# EAGLE design power (EAGLE 7.3.0)
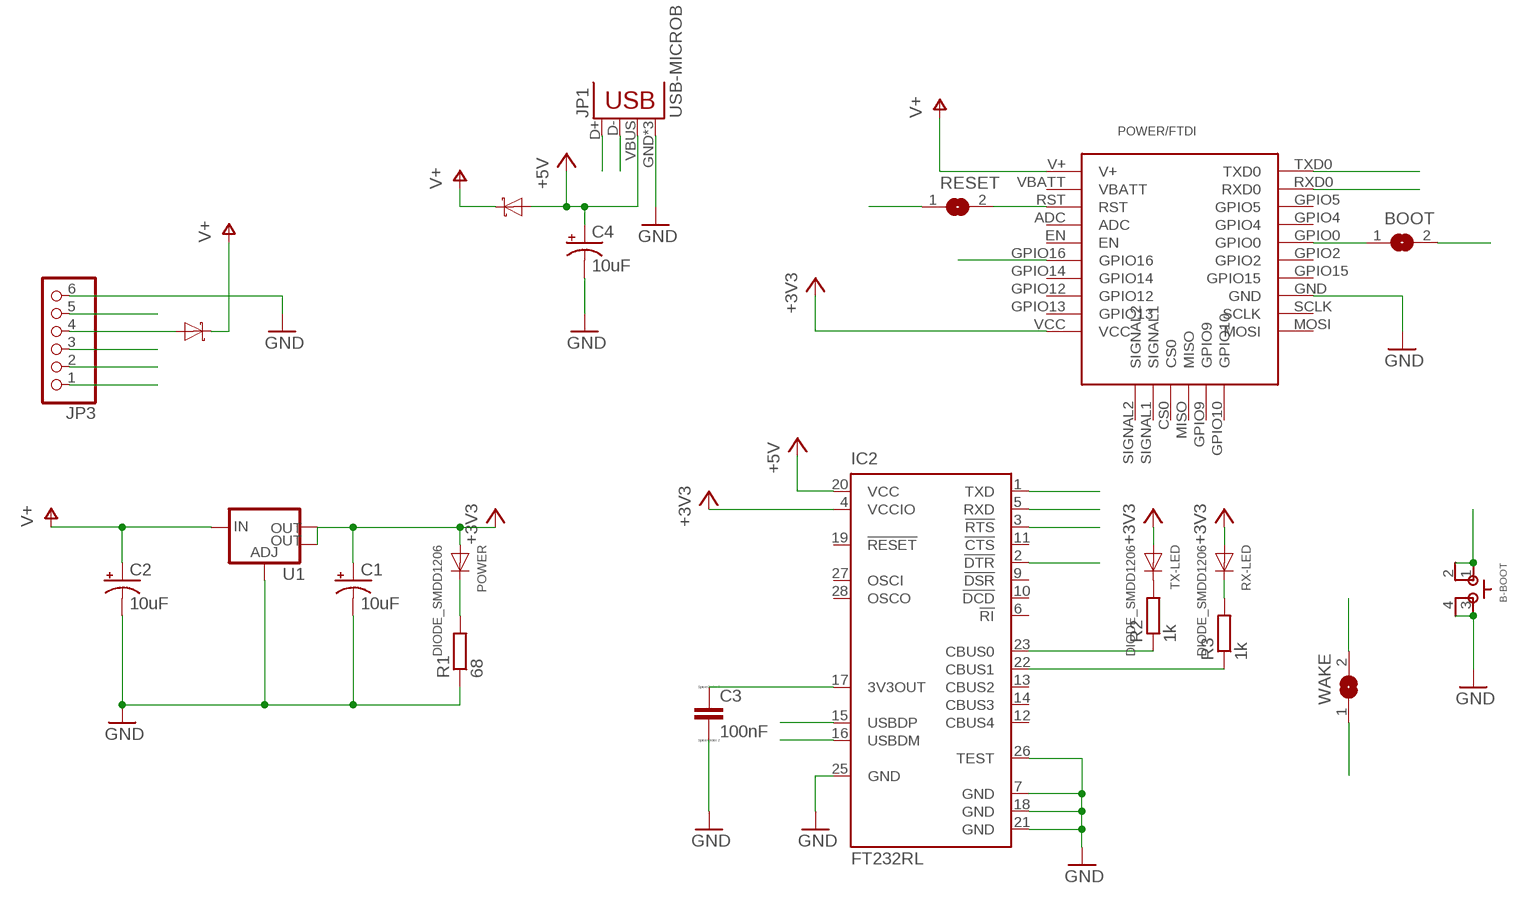
[diagram p0: schematic, sheet 1]

## Parts
B-BOOT  SKSCLDE010  [SKSCLDE010]
BOOT  SJ  [SJ]
C1  10uF  10UF-16V-10%(TANT)  [EIA3216]
C2  10uF  10UF-16V-10%(TANT)  [EIA3216]
C3  100nF  C  [C0805]
C4  10uF  10UF-16V-10%(TANT)  [EIA3216]
D1  MBR120  SCHOTTKY_DIODE_SMDSOD123  [SOD123]
D2  MBR120  SCHOTTKY_DIODE_SMDSOD123  [SOD123]
IC2  FT232RL  [SSOP28]
JP1  USB-MICROB  [USB-MICROB]
JP3  PINHD-1X6  [1X06]
POWER  DIODE_SMDD1206  [D1206]
POWER/FTDI  ESP-BOARD  [ESP-BOARD]
R1  68  RESISTOR-1206  [R1206]
R2  1k  RESISTOR-1206  [R1206]
R3  1k  RESISTOR-1206  [R1206]
RESET  SJ  [SJ]
RX-LED  DIODE_SMDD1206  [D1206]
TX-LED  DIODE_SMDD1206  [D1206]
U1  V_REG_LM1117SOT223  [SOT223]
WAKE  SJ  [SJ]

## Nets
+3V3: C1.A(+) IC2.4(VCCIO) POWER.A POWER/FTDI.VCC RX-LED.A TX-LED.A U1.2(OUT) U1.4(OUT)
+5V: C4.A(+) D1.A IC2.20(VCC) JP1.VBUS
D+: IC2.15(USBDP) JP1.D+
D-: IC2.16(USBDM) JP1.D-
DTR: B-BOOT.1 B-BOOT.2 BOOT.2 IC2.2(!DTR) JP3.5
GND: B-BOOT.3 B-BOOT.4 C1.C(-) C2.C(-) C3.2 C4.C(-) IC2.18(GND) IC2.21(GND) IC2.25(GND) IC2.26(TEST) JP1.GND JP1.MT1(GND) JP1.MT2(GND) JP3.6 POWER/FTDI.GND R1.1 U1.1(ADJ)
GPIO0: BOOT.1 POWER/FTDI.GPIO0
GPIO16: POWER/FTDI.GPIO16 WAKE.1
N$1: POWER.K R1.2
N$2: IC2.22(CBUS1) R3.1
N$3: R2.2 TX-LED.K
N$4: IC2.23(CBUS0) R2.1
N$8: D2.A JP3.4
N$9: R3.2 RX-LED.K
N$16: C3.1 IC2.17(3V3OUT)
RST: POWER/FTDI.RST RESET.2 WAKE.2
RTS: IC2.3(!RTS) JP3.1 RESET.1
RXD: IC2.5(RXD) JP3.2 POWER/FTDI.TXD0
TXD: IC2.1(TXD) JP3.3 POWER/FTDI.RXD0
V+: C2.A(+) D1.C D2.C POWER/FTDI.V+ U1.3(IN)
Unconnected: IC2.6(!RI) IC2.9(!DSR) IC2.10(!DCD) IC2.11(!CTS) IC2.12(CBUS4) IC2.13(CBUS2) IC2.14(CBUS3) IC2.19(!RESET) IC2.27(OSCI) IC2.28(OSCO) POWER/FTDI.ADC POWER/FTDI.CS0 POWER/FTDI.EN POWER/FTDI.GPIO2 POWER/FTDI.GPIO4 POWER/FTDI.GPIO5 POWER/FTDI.GPIO9 POWER/FTDI.GPIO10 POWER/FTDI.GPIO12 POWER/FTDI.GPIO13 POWER/FTDI.GPIO14 POWER/FTDI.GPIO15 POWER/FTDI.MISO POWER/FTDI.MOSI POWER/FTDI.SCLK POWER/FTDI.SIGNAL1 POWER/FTDI.SIGNAL2

## Power pins joined to a net without a drawn wire
GND: IC2.7(GND)
VBATT: POWER/FTDI.VBATT

## Library data of the parts
B-BOOT = ESPstack:SKSCLDE010
BOOT RESET WAKE = jumper:SJ: SMD solder JUMPER
C1 C2 C4 = SparkFun-Capacitors:10UF-16V-10%(TANT): CAP-00811 1206/EIA-3216 Tantalum capacitor; PROD_ID: CAP-00811
C3 = eagle-ltspice:C: CAPACITOR, European symbol; SPICEMODEL: NONE; SPICEPREFIX: C
D1 D2 = ESPstack:SCHOTTKY_DIODE_SMD: Schottky Diode Library Unspecified diode types but packages D0805 doplnit D0605 SMA SMB SMC SOD123 SOD323
IC2 = ftdichip:FT232R: Source: http://www.ftdichip.com/Documents/DataSheets/DS_FT232R_v104.pdf; MPN: FT232RL; OC_FARNELL: 1146032; OC_NEWARK: 91K9918
JP1 = SparkFun-Connectors:USB: USB Connectors USB-B-PTH is fully proven SKU : PRT-00139/CONN-08278 USB-miniB is fully proven SKU : PRT-00587 USB-A-PCB is untested. USB-A-H is throughly reviewed, but untested. Spark Fun Electronics SKU : PRT-00437 USB-B-SMT is throughly reviewed, but untested. Needs silkscreen touching up. USB-A-S has not been used/tested USB-MB-H has not been used/tested USB-MICROB has been used. CONN-09505; PROD_ID: CONN-09505
JP3 = ESPstack:PINHD-1X6: PIN HEADER
POWER RX-LED TX-LED = diodes_gen:DIODE_SMD: General Purpose Diode Library Unspecified diode types but packages D0805 doplnit D0605 D1206 SMA SMB SMC SOD123 SOD323 Diodes in 0603 package Typ Farnell number Link Notes TS4148RZG 8150192 Link <http://cz.farnell.com/taiwan-semiconductor/ts4148-rzg/diode-0-35a-603/dp/8150192> 1N41448 alt CD0603-S01xxx 7599754 Link <http://cz.farnell.com/bourns/cd0603-s0180r/switching-diode-90v-100ma-0603/dp/7599754> 1N41448 alt Diodes in 0805 package Typ Farnell number Link Notes TS4148RY 8150206 Link <http://cz.farnell.com/taiwan-semiconductor/ts4148-ry/diode-0-5a-0805-100v/dp/8150206> 1n4148 alt Diodes in 1202 package Typ Farnell number Link Notes TS4148RX 8150214 Link <http://cz.farnell.com/taiwan-semiconductor/ts4148-rx/diode-small-signal-100v-0-15a-1206/dp/8150214> CD1206-S01575 7599821 Link <http://cz.farnell.com/bourns/cd1206-s01575/switching-diode-100v-150ma-1206/dp/7599821> Diodes in SOD123 package Typ Farnell number Link Notes Link Diodes in SOD323 package Typ Farnell number Link Notes Link Diodes in SMA package Typ Farnell number Link Notes Link Diodes in SMB package Typ Farnell number Link Notes Link Diodes in SMC package Typ Farnell number Link Notes Link
POWER/FTDI = ESPstack:ESP-BOARD: STANDARIZED ESP-STACK BOARD
R1-R3 = dp_devices:RESISTOR
U1 = SparkFun-PowerIC:V_REG_LM1117: Voltage Regulator LM1117 Standard adjustable voltage regulator but in SMD form. Spark Fun Electronics SKU : COM-00595; PROD_ID: VREG-08170

## Board
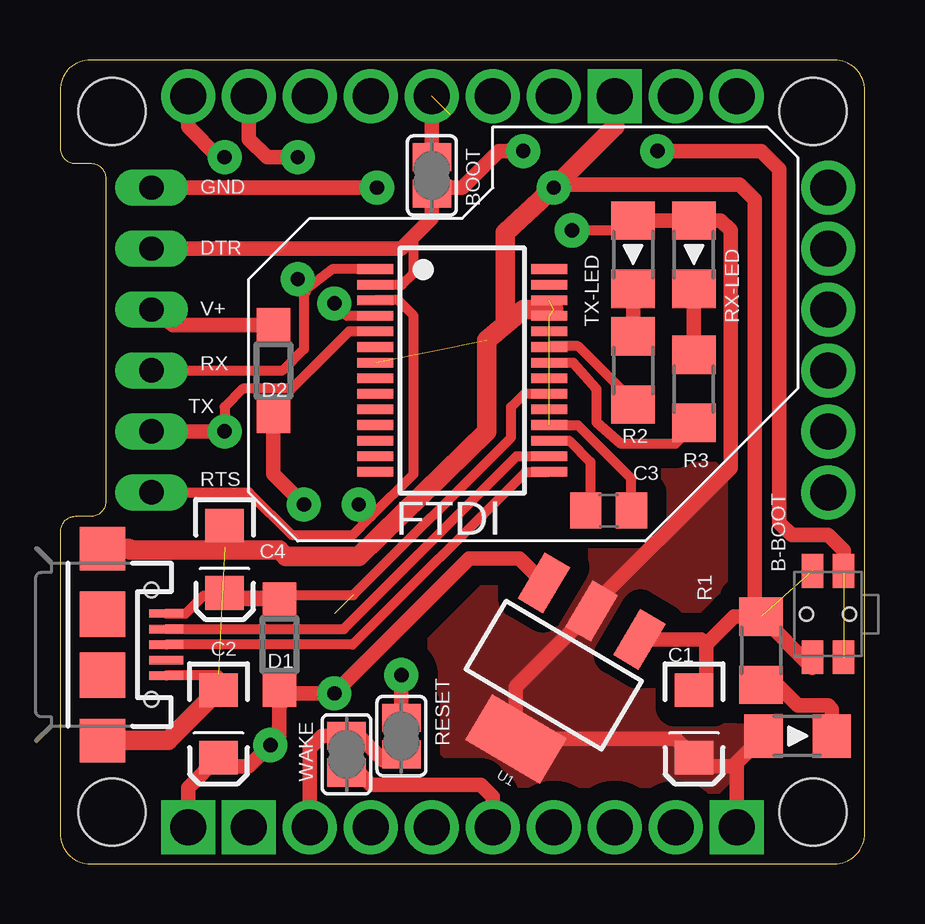
[diagram p1: board, top side]
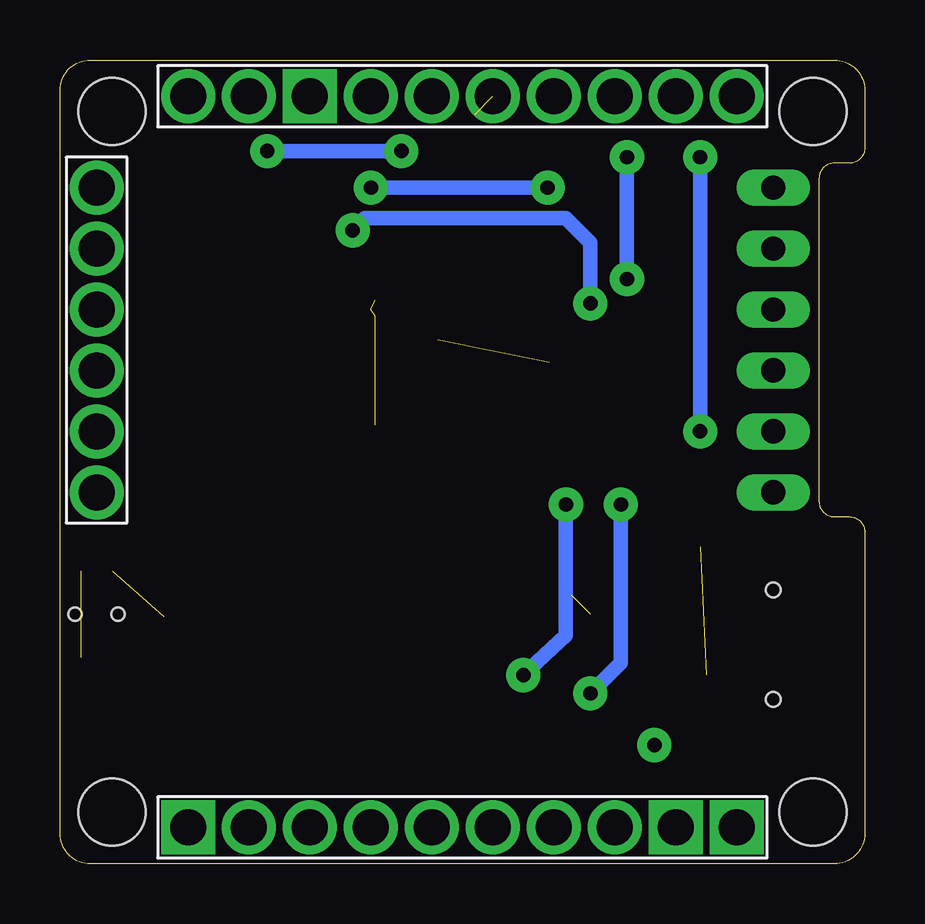
[diagram p2: board, bottom side, seen from below]

Size 33.53 x 33.52 mm. Coordinates in mm from the lower left corner, seen from the top.
Outline: 0,13.84 0,1.27 arc90 1.27,0 32.26,0 arc90 33.53,1.27 33.53,32.25 arc90 32.26,33.52 1.27,33.52 arc90 0,32.25 0,29.84 arc90 0.64,29.21 1.27,29.21 arc-90 1.9,28.58 1.9,15.11 arc-90 1.27,14.48 0.64,14.48 arc90 0,13.84
Copper layers (1*16): Top 0.0356mm / dielectric 1.5011mm / Bottom 0.0356mm
Design rules "LaenPCBOrder": minimum track width 6mil, minimum drill 13mil, track to track 6mil, track to pad 6mil, pad to pad 6mil, via to via 6mil, smd to smd 6mil, copper to edge 15mil, drill to drill 6mil, minimum pad ring 7mil, minimum via ring 7mil, stop-mask expansion 3mil, vias tented up to drill 0mil, thermal gap 10mil
Holes 0.6 mm at 3.81,11.43 3.81,6.86

### Footprints (pad centres in the part's own frame; a part is rotated, then mirrored left to right if it is on the bottom)
SKSCLDE010 = smd 1.4 x 0.9: 1 -1.8,-0.65; 2 1.8,-0.65; 3 -1.8,0.65; 4 1.8,0.65 | hole 0.55: 0,0.9; 0,-0.9
SJ = smd 1.168 x 1.6: 1 -0.762,0; 2 0.762,0
EIA3216 = smd 1.4 x 1.6: A 1.4,0; C -1.4,0
C0805 = smd 1.3 x 1.5: 1 -0.95,0; 2 0.95,0
SOD123 = smd 1.4 x 1.4: A 1.9,0; C -1.9,0
SSOP28 = smd 0.4 x 1.5: 1 -4.225,-3.625; 2 -3.575,-3.625; 3 -2.925,-3.625; 4 -2.275,-3.625; 5 -1.625,-3.625; 6 -0.975,-3.625; 7 -0.325,-3.625; 8 0.325,-3.625; 9 0.975,-3.625; 10 1.625,-3.625; 11 2.275,-3.625; 12 2.925,-3.625; 13 3.575,-3.625; 14 4.225,-3.625; 15 4.225,3.625; 16 3.575,3.625; 17 2.925,3.625; 18 2.275,3.625; 19 1.625,3.625; 20 0.975,3.625; 21 0.325,3.625; 22 -0.325,3.625; 23 -0.975,3.625; 24 -1.625,3.625; 25 -2.275,3.625; 26 -2.925,3.625; 27 -3.575,3.625; 28 -4.225,3.625
USB-MICROB = smd 0.35 x 1.4: D+ 0,2.65; D- -0.65,2.65; GND 1.3,2.65; ID 0.65,2.65; VBUS -1.3,2.65 | smd 1.8 x 1.9: MT1 -4,0; MT2 4,0 | smd 1.9 x 1.9: P$1 -1.27,0; P$2 1.27,0
1X06 = drill 1.016 long: 1 -6.35,0; 2 -3.81,0; 3 -1.27,0; 4 1.27,0; 5 3.81,0; 6 6.35,0
D1206 = smd 1.6 x 1.803: A -1.422,0; K 1.422,0
ESP-BOARD = drill 1.5 pad 2.184: ADC -10.16,-16.51; CS0 8.89,2.54; EN -7.62,-16.51; GPIO0 -7.62,13.97; GPIO2 -5.08,13.97; GPIO4 -10.16,13.97; GPIO5 -12.7,13.97; GPIO9 8.89,7.62; GPIO10 8.89,10.16; GPIO12 0,-16.51; GPIO13 2.54,-16.51; GPIO14 -2.54,-16.51; GPIO15 -2.54,13.97; GPIO16 -5.08,-16.51; MISO 8.89,5.08; MOSI 5.08,13.97; RST -12.7,-16.51; RXD0 -15.24,13.97; SCLK 2.54,13.97; SIGNAL1 8.89,0; SIGNAL2 8.89,-2.54; TXD0 -17.78,13.97 | drill 1.5 pad 2.184 square: GND 0,13.97; V+ -17.78,-16.51; VBATT -15.24,-16.51; VCC 5.08,-16.51 | hole 2.8: 8.255,13.335; -20.955,13.335; 8.255,-15.875; -20.955,-15.875
R1206 = smd 1.6 x 1.803: 1 -1.422,0; 2 1.422,0
SOT223 = smd 1.219 x 2.235: 1 -2.311,-3.099; 2 0,-3.099; 3 2.311,-3.099 | smd 3.6 x 2.2: 4 0,3.099

### Placement (x,y rotation side)
B-BOOT  32,10.41 90 top
BOOT  15.49,28.7 270 top
C1  26.42,5.84 270 top
C2  6.6,5.84 270 top
C3  22.86,14.73 0 top
C4  6.86,12.7 270 top
D1  9.14,9.14 90 top
D2  8.89,20.57 90 top
IC2  16.76,20.57 270 top
JP1  1.78,9.14 270 top
JP3  3.81,21.84 90 top
POWER  30.73,5.33 0 top
POWER/FTDI  23.11,18.03 0 top
R1  29.21,8.89 270 top
R2  23.88,20.57 90 top
R3  26.42,19.81 90 top
RESET  14.22,5.33 270 top
RX-LED  26.42,25.4 270 top
TX-LED  23.88,25.4 270 top
U1  20.57,7.87 149.4 top
WAKE  11.94,4.57 90 top

### Tracks (layer width: path | path; a pad name or v marks a point on that pad's centre or on a via)
+3V3  (via drill 0.6 pad 1.42)
  Top 0.406: IC2.4 11.95,22.85 v11.43,23.37 | v21.34,26.42 23.47,26.42 TX-LED.A
  Top 0.61: POWER/FTDI.VCC 28.19,4.22 | 28.19,4.22 POWER.A | 28.19,4.22 28.04,4.06 26.92,4.06 26.55,4.44 C1.A 25.65,5.21 U1.4 19,7.39 U1.2 | RX-LED.A TX-LED.A 27.53,26.82 27.94,26.42 27.94,16.51 21.84,10.41
  Bottom 0.61: v11.43,23.37 11.43,25.91 12.45,26.92 20.83,26.92 v21.34,26.42
  pour Top (isolate 0.813, no thermals): 15.49,9.14 15.49,5.33 18.03,2.79 26.92,2.79 28.19,4.06 28.19,15.49 26.92,16.76 21.84,16.76 15.49,10.41
+5V  (1 unrouted)
  Top 0.406: IC2.20 19.34,19.6 18.8,19.05 18.8,17.78 12.22,11.21 9.27,11.21 | JP1.VBUS 5.24,10.44 5.97,11.18 9.27,11.21 | D1.A 9.27,11.21
  Top 0.61: C4.A 6.86,11.04 D1.A
D+
  Top 0.406: JP1.D+ 12.19,9.14 19.4,16.35 IC2.15
D-
  Top 0.406: JP1.D- 11.83,9.79 19.03,17 IC2.16
DTR  (via drill 0.6 pad 1.42)  (1 unrouted)
  Top 0.406: IC2.2 14.24,24.15 14.73,24.64 14.73,26.16 14.99,26.42
  Top 0.61: B-BOOT.2 32.65,13.07 32,13.72 30.48,13.72 29.97,14.22 29.97,28.96 29.21,29.72 v24.89,29.72 | v19.3,29.72 18.29,29.72 16.76,28.19 15.75,28.19 BOOT.2 15.49,26.92 14.99,26.42 14.22,25.65 JP3.5
  Bottom 0.61: v24.89,29.72 v19.3,29.72
GND  (via drill 0.6 pad 1.42)  (7 unrouted)
  Top 0.406: JP1.GND 4.46,7.87 6.6,7.87 C2.C | C3.2 23.81,16.07 21.59,18.29 20.4,18.29 IC2.18
  Top 0.61: JP3.6 v13.21,28.19 | v20.57,28.19 20.7,28.32 28.32,28.32 28.96,27.69 28.96,10.57 R1.1 | B-BOOT.3 31.35,8.17 R1.1 | C1.C 26.92,7.75 26.92,9.14 | R1.1 28.09,10.31 26.92,9.14 | C4.C 6.86,13.21 6.86,13.08 | U1.1 26.7,9.37 26.92,9.14
  Top 0.813: JP1.MT1 2.86,13.14 2.92,13.08 6.86,13.08 9.14,13.08 9.4,12.83 12.45,12.83 17.78,18.03 17.78,21.84 18.55,22.49 | 18.55,22.49 19.3,23.11 20.57,23.11 | v20.57,28.19 18.54,26.31 18.55,22.49 | 20.7,28.32 23.11,30.73 POWER/FTDI.GND | JP1.MT2 4.51,5.14 C2.C
  Bottom 0.61: v13.21,28.19 v20.57,28.19
GPIO0  (1 unrouted)
  Top 0.61: BOOT.1 POWER/FTDI.GPIO0
GPIO16
  Top 0.61: WAKE.1 12.45,3.81 12.95,3.3 17.53,3.3 18.03,2.79 POWER/FTDI.GPIO16
N$1
  Top 0.61: POWER.K 32.16,6.45 32,6.6 30.73,6.6 29.46,7.87 29.46,7.72 R1.2
N$2
  Top 0.406: IC2.22 21.39,20.9 22.35,19.81 22.35,18.41 23.37,17.53 25.65,17.53 25.81,17.68 25.81,17.78 R3.1
N$3
  Top 0.61: R2.2 TX-LED.K
N$4
  Top 0.406: R2.1 23.88,19.3 21.59,21.59 20.43,21.59 IC2.23
N$8
  Top 0.61: JP3.4 4.7,22.47 D2.A
N$9
  Top 0.61: R3.2 RX-LED.K
N$16
  Top 0.406: IC2.17 21.21,17.65 22.1,16.76 22.1,14.92 C3.1
RST
  Top 0.61: POWER/FTDI.RST 10.41,4.83 10.92,5.33 WAKE.2 12.45,5.33 13.46,4.32 13.97,4.32 RESET.2
RTS  (via drill 0.6 pad 1.42)
  Top 0.406: JP3.1 7.87,15.49 9.65,13.72 12.19,13.72 12.95,14.48 | 12.95,14.48 14.73,16.26 14.73,22.86 14.09,23.5 IC2.3 | v12.45,14.99 12.95,14.48
  Top 0.61: RESET.1 v14.22,7.87
  Bottom 0.61: v14.22,7.87 12.45,9.53 v12.45,14.99
RXD  (via drill 0.6 pad 1.42)
  Top 0.406: IC2.5 12.04,22.2 9.65,19.81 7.62,19.81 6.86,19.05 v6.86,18.03
  Top 0.61: POWER/FTDI.TXD0 5.33,30.73 6.6,29.46 v6.86,29.46 | v6.86,18.03 JP3.2
  Bottom 0.61: v6.86,29.46 v6.86,18.03
TXD  (via drill 0.6 pad 1.42)
  Top 0.406: JP3.3 9.27,20.57 10.16,21.46 10.16,23.88 11.34,24.8 IC2.1
  Top 0.61: POWER/FTDI.RXD0 7.87,30.23 8.64,29.46 v9.91,29.46 | v9.91,24.38 9.91,24.13 10.16,23.88
  Bottom 0.61: v9.91,29.46 v9.91,24.38
V+  (via drill 0.6 pad 1.42)
  Top 0.61: POWER/FTDI.V+ 5.33,3.17 C2.A 6.98,4.06 7.87,4.06 v8.76,4.95 9.14,5.33 9.14,6.6 | D1.C 9.14,6.6 | D2.C 8.89,16.26 v10.16,14.99 | 9.14,6.6 9.65,7.11 v11.43,7.11 17.06,12.74 19.14,12.74 U1.3
  Bottom 0.61: v10.16,14.99 10.16,8.38 v11.43,7.11

### Text on the board
tPlace: GND | DTR | V+ | RX | TX | RTS | FTDI